# Altium schematic sheet fram.SchDoc
size A4; SheetNumber: 8; SheetTotal: 14
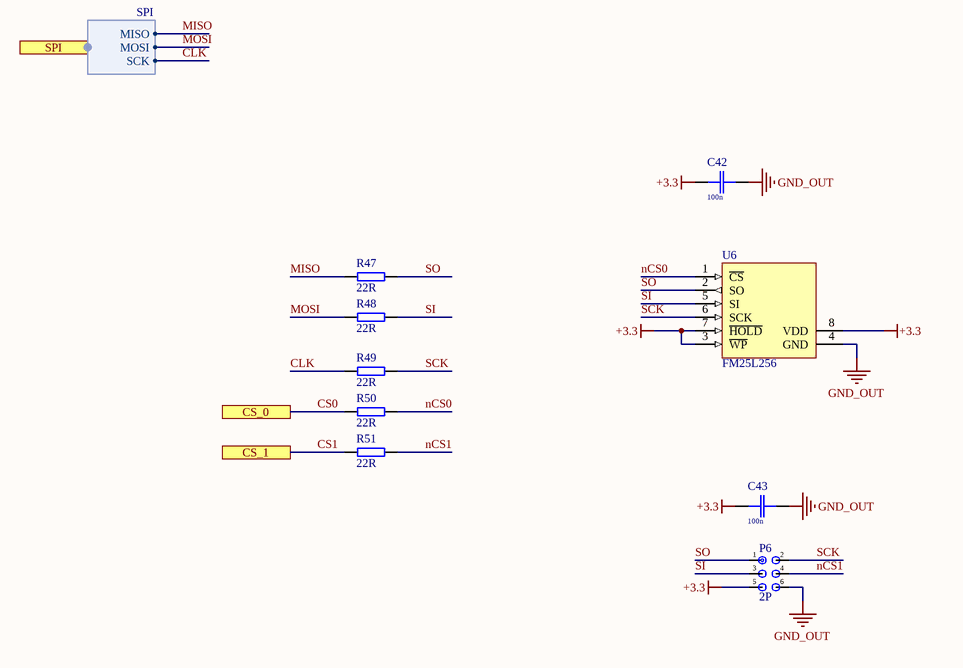
[diagram p0: fram.SchDoc]

## Parts
C42  100n  [C0603]
C43  100n  [C0603]
P6  2P  [CON: PLS-6]
R47  22R  [RES: 0603]
R48  22R  [RES: 0603]
R49  22R  [RES: 0603]
R50  22R  [RES: 0603]
R51  22R  [RES: 0603]
U6  FM25L256  [SOIC127P600X175-8M]

## Ports
CS_0, CS_1, SPI (harness SPI)

## Harnesses
SPI: MISO, SCK, MOSI

## Nets
+3.3: C42.1 C43.1 P6.5 U6.3(~{WP}) U6.7(~{HOLD}) U6.8(VDD)
GND_OUT: C42.2 C43.2 P6.6 U6.4(GND)
CLK: R49.2 ; port SPI.SCK
CS0: R50.2 ; port CS_0
CS1: R51.2 ; port CS_1
MISO: R47.2 ; port SPI.MISO
MOSI: R48.2 ; port SPI.MOSI
nCS0: R50.1 U6.1(~{CS})
nCS1: P6.4 R51.1
SCK: P6.2 R49.1 U6.6(SCK)
SI: P6.3 R48.1 U6.5(SI)
SO: P6.1 R47.1 U6.2(SO)

## Library data of the parts
C42 C43 = C-0603: SMD-0603; Price: 0.014; Value: 100n
P6 = PLS_PBD_6: Value: 2P
R47-R51 = R_SMD: Value: 22R